# Altium project OZ440-SE140-CAR001.PrjPcb (part 2 of 2)
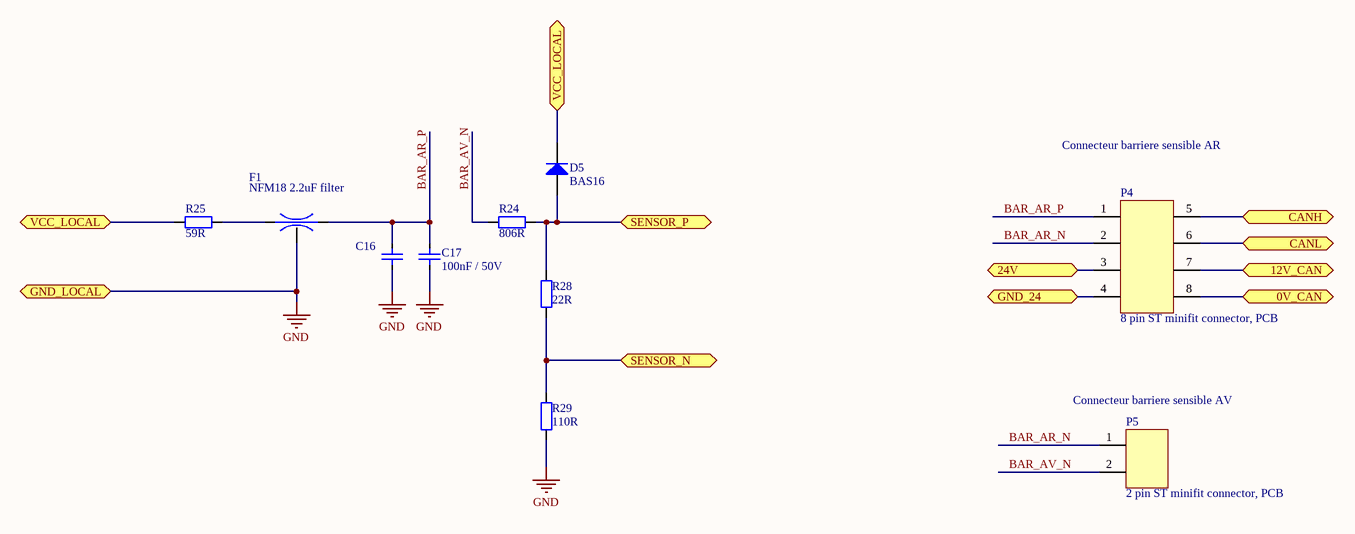
[diagram p6: OZ440-SE140-CAR001_sheet6_Sensor_Connector.SchDoc]

## Nets that join several sheets
3V3_CH1: OZ440-SE140-CAR001_sheet1 (D4.1), U_OZ440-SE140-CAR001_sheet4_Engagement_block (13 pins), U_OZ440-SE140-CAR001_sheet2_power_supply (C4_U_OZ440-SE140-CAR001_sheet2_power_supply#3.2 L1_U_OZ440-SE140-CAR001_sheet2_power_supply#3.2 R1_U_OZ440-SE140-CAR001_sheet2_power_supply#3.2), OZ440-SE140-CAR001_sheet6_Sensor_Connector (D5.3 R25.1)
GND: OZ440-SE140-CAR001_sheet1 (7 pins), U_OZ440-SE140-CAR001_sheet2_power_supply (8 pins), U_OZ440-SE140-CAR001_sheet2_power_supply (8 pins), U_OZ440-SE140-CAR001_sheet3_Power_Switch (5 pins), U_OZ440-SE140-CAR001_sheet3_Power_Switch (5 pins), U_OZ440-SE140-CAR001_sheet4_Engagement_block (13 pins), U_OZ440-SE140-CAR001_sheet4_Engagement_block (13 pins), U_OZ440-SE140-CAR001_sheet2_power_supply (8 pins), OZ440-SE140-CAR001_sheet5_enable_delay (6 pins), U_OZ440-SE140-CAR001_sheet3_Power_Switch (5 pins), OZ440-SE140-CAR001_sheet6_Sensor_Connector (5 pins)
PIC_PWR: OZ440-SE140-CAR001_sheet1 (J2.9), U_OZ440-SE140-CAR001_sheet2_power_supply (C4_U_OZ440-SE140-CAR001_sheet2_power_supply#1.2 L1_U_OZ440-SE140-CAR001_sheet2_power_supply#1.2 R1_U_OZ440-SE140-CAR001_sheet2_power_supply#1.2), OZ440-SE140-CAR001_sheet5_enable_delay (C15.1 J1.1 U8.5)
VCC: U_OZ440-SE140-CAR001_sheet2_power_supply (C4_U_OZ440-SE140-CAR001_sheet2_power_supply#2.2 L1_U_OZ440-SE140-CAR001_sheet2_power_supply#2.2 R1_U_OZ440-SE140-CAR001_sheet2_power_supply#2.2), U_OZ440-SE140-CAR001_sheet4_Engagement_block (13 pins)
0V_CAN: OZ440-SE140-CAR001_sheet1 (J2.1), OZ440-SE140-CAR001_sheet6_Sensor_Connector (P4.8)
12V_CAN: OZ440-SE140-CAR001_sheet1 (J2.3), OZ440-SE140-CAR001_sheet6_Sensor_Connector (P4.7)
~{CPU_PG}: OZ440-SE140-CAR001_sheet1 (J2.16), U_OZ440-SE140-CAR001_sheet3_Power_Switch (U3_U_OZ440-SE140-CAR001_sheet3_Power_Switch#3.8)
~{PWR1_PG}: OZ440-SE140-CAR001_sheet1 (J2.8), U_OZ440-SE140-CAR001_sheet3_Power_Switch (U3_U_OZ440-SE140-CAR001_sheet3_Power_Switch#1.8)
~{PWR2_PG}: OZ440-SE140-CAR001_sheet1 (J2.10), U_OZ440-SE140-CAR001_sheet3_Power_Switch (U3_U_OZ440-SE140-CAR001_sheet3_Power_Switch#2.8)
~{Rese}t_PIC: OZ440-SE140-CAR001_sheet1 (J2.11), OZ440-SE140-CAR001_sheet5_enable_delay (J1.2 R19.1 U8.6)
CANH: OZ440-SE140-CAR001_sheet1 (J2.7), OZ440-SE140-CAR001_sheet6_Sensor_Connector (P4.5)
CANL: OZ440-SE140-CAR001_sheet1 (J2.5), OZ440-SE140-CAR001_sheet6_Sensor_Connector (P4.6)
MAIN_POWER: OZ440-SE140-CAR001_sheet1 (J2.14 P2.1 P2.3 U1.4), U_OZ440-SE140-CAR001_sheet2_power_supply (C2_U_OZ440-SE140-CAR001_sheet2_power_supply#1.2 C3_U_OZ440-SE140-CAR001_sheet2_power_supply#1.2 U2_U_OZ440-SE140-CAR001_sheet2_power_supply#1.2), U_OZ440-SE140-CAR001_sheet3_Power_Switch (5 pins)
MAIN_POWER_OUT: OZ440-SE140-CAR001_sheet1 (F2.1 P3.1), U_OZ440-SE140-CAR001_sheet3_Power_Switch (7 pins)
MAIN_POWER_SWITCHED: OZ440-SE140-CAR001_sheet1 (J2.12 P2.2), U_OZ440-SE140-CAR001_sheet2_power_supply (C2_U_OZ440-SE140-CAR001_sheet2_power_supply#2.2 C3_U_OZ440-SE140-CAR001_sheet2_power_supply#2.2 U2_U_OZ440-SE140-CAR001_sheet2_power_supply#2.2), U_OZ440-SE140-CAR001_sheet3_Power_Switch (5 pins), U_OZ440-SE140-CAR001_sheet2_power_supply (C2_U_OZ440-SE140-CAR001_sheet2_power_supply#3.2 C3_U_OZ440-SE140-CAR001_sheet2_power_supply#3.2 U2_U_OZ440-SE140-CAR001_sheet2_power_supply#3.2), OZ440-SE140-CAR001_sheet5_enable_delay (R20.2)
NetC7_U_OZ440-SE140-CAR001_sheet3_Power_Switch#2_2: U_OZ440-SE140-CAR001_sheet3_Power_Switch (7 pins), U_OZ440-SE140-CAR001_sheet3_Power_Switch (5 pins)
NetC8_U_OZ440-SE140-CAR001_sheet3_Power_Switch#3_1: OZ440-SE140-CAR001_sheet1 (F1#1.1), U_OZ440-SE140-CAR001_sheet3_Power_Switch (7 pins)
NetF2_2: OZ440-SE140-CAR001_sheet1 (F2.2), OZ440-SE140-CAR001_sheet6_Sensor_Connector (P4.3)
NetQ2_U_OZ440-SE140-CAR001_sheet4_Engagement_block#1_3: U_OZ440-SE140-CAR001_sheet3_Power_Switch (U3_U_OZ440-SE140-CAR001_sheet3_Power_Switch#2.5), U_OZ440-SE140-CAR001_sheet4_Engagement_block (Q2_U_OZ440-SE140-CAR001_sheet4_Engagement_block#1.3 R27_U_OZ440-SE140-CAR001_sheet4_Engagement_block#1.1)
NetQ2_U_OZ440-SE140-CAR001_sheet4_Engagement_block#2_3: U_OZ440-SE140-CAR001_sheet3_Power_Switch (U3_U_OZ440-SE140-CAR001_sheet3_Power_Switch#1.5), U_OZ440-SE140-CAR001_sheet4_Engagement_block (Q2_U_OZ440-SE140-CAR001_sheet4_Engagement_block#2.3 R27_U_OZ440-SE140-CAR001_sheet4_Engagement_block#2.1)
NetU3_U_OZ440-SE140-CAR001_sheet3_Power_Switch#3_5: OZ440-SE140-CAR001_sheet5_enable_delay (U8.4), U_OZ440-SE140-CAR001_sheet3_Power_Switch (U3_U_OZ440-SE140-CAR001_sheet3_Power_Switch#3.5)
POWER1_EN_DELAYED: U_OZ440-SE140-CAR001_sheet4_Engagement_block (Q2_U_OZ440-SE140-CAR001_sheet4_Engagement_block#2.1), OZ440-SE140-CAR001_sheet5_enable_delay (R22.2)
POWER2_EN_DELAYED: U_OZ440-SE140-CAR001_sheet4_Engagement_block (Q2_U_OZ440-SE140-CAR001_sheet4_Engagement_block#1.1), OZ440-SE140-CAR001_sheet5_enable_delay (R23.2)
SENSOR_N: U_OZ440-SE140-CAR001_sheet4_Engagement_block (R17_U_OZ440-SE140-CAR001_sheet4_Engagement_block#1.1), U_OZ440-SE140-CAR001_sheet4_Engagement_block (R17_U_OZ440-SE140-CAR001_sheet4_Engagement_block#2.1), OZ440-SE140-CAR001_sheet6_Sensor_Connector (R28.1 R29.2)
SENSOR_P: U_OZ440-SE140-CAR001_sheet4_Engagement_block (R16_U_OZ440-SE140-CAR001_sheet4_Engagement_block#1.1), U_OZ440-SE140-CAR001_sheet4_Engagement_block (R16_U_OZ440-SE140-CAR001_sheet4_Engagement_block#2.1), OZ440-SE140-CAR001_sheet6_Sensor_Connector (D5.1 R24.1 R28.2)

## Assembly variants
V1.0: not fitted R16 R17 R22 R23 R28 R29